# EAGLE design charger_v1 (EAGLE 4.16)
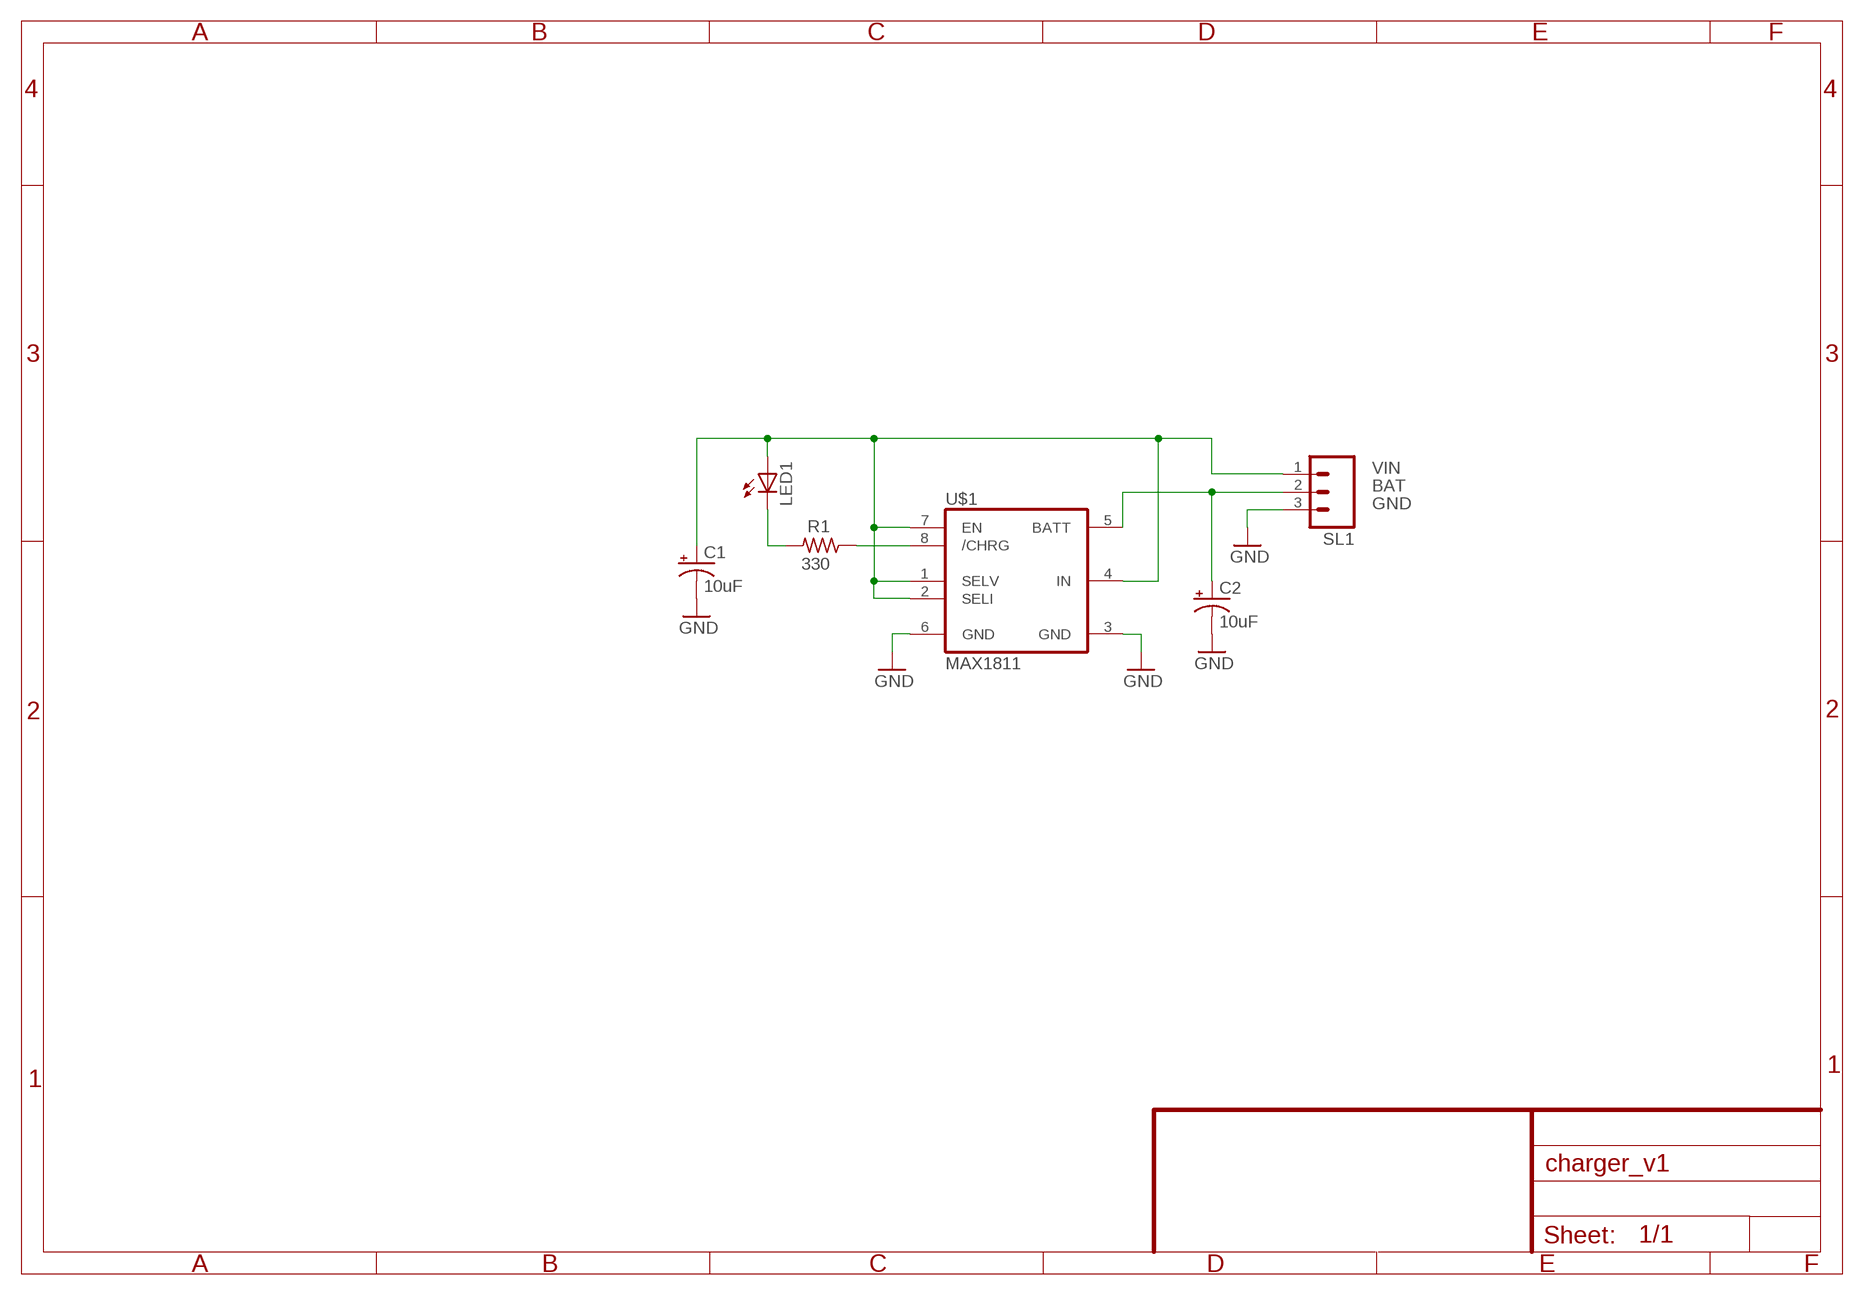
[diagram p0: schematic, sheet 1]

## Parts
C1  10uF  CAP_POL1206  [EIA3216]
C2  10uF  CAP_POL1206  [EIA3216]
LED1  LED1206  [LED-1206]
R1  330  R-US_0207/10  [0207/10]
SL1  M03PTH  [1X03]
U$1  MAX1811  [SO08]

## Nets
BAT: C2.A(+) SL1.2 U$1.5(BATT)
GND: C1.C(-) C2.C(-) SL1.3 U$1.3(GND) U$1.6(GND)
N$2: LED1.C R1.2
N$3: R1.1 U$1.8(/CHRG)
VIN: C1.A(+) LED1.A SL1.1 U$1.1(SELV) U$1.2(SELI) U$1.4(IN) U$1.7(EN)

## Library data of the parts
C1 C2 = SparkFunEagle-6-6-07:CAP_POL: Capacitor Polarized These are standard SMD and PTH capacitors. Normally 10uF, 47uF, and 100uF in electrolytic and tantalum varieties. Always verify the external diameter of the through hole cap, it varies with capacity, voltage, and manufacturer. The EIA devices should be standard.
LED1 = SparkFunEagle-6-6-07:LED: LEDs Standard schematic elements and footprints for 5mm, 3mm, 1206, and 0603 sized LEDs. 5mm - Spark Fun Electronics SKU : COM-00529 (and others)
R1 = rcl:R-US_: RESISTOR, American symbol
SL1 = SparkFunEagle-6-6-07:M03: Header 3 Standard 3-pin 0.1" header. Use with straight break away headers (SKU : PRT-00116), right angle break away headers (PRT-00553), swiss pins (PRT-00743), machine pins (PRT-00117), and female headers (PRT-00115). Molex polarized connector foot print use with SKU : PRT-08232 with associated crimp pins and housings.
U$1 = max1811:MAX1811

## Board
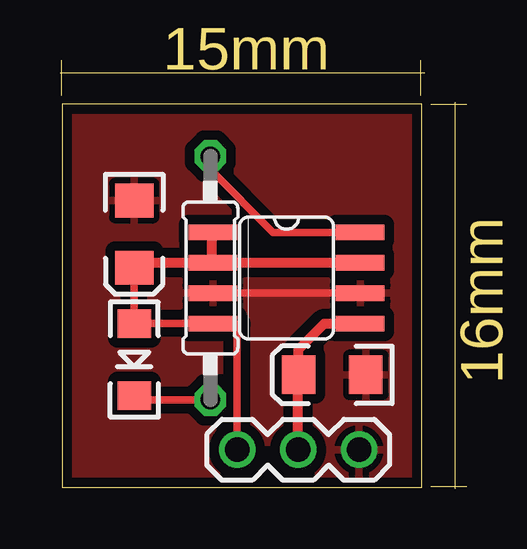
[diagram p1: board, top side]
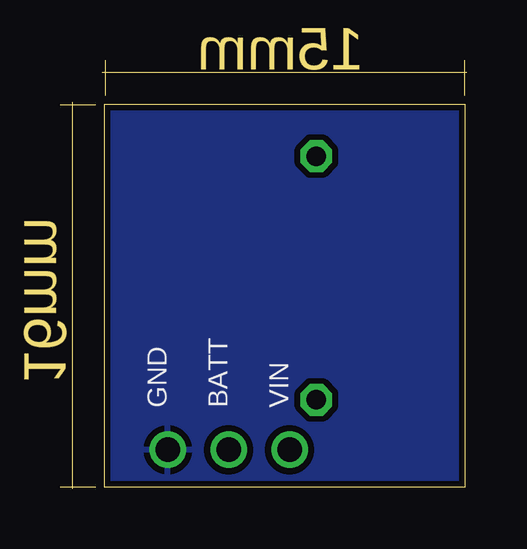
[diagram p2: board, bottom side, seen from below]

Size 16.97 x 17.88 mm. Coordinates in mm from the lower left corner, seen from the top.
Outline: 0.08,16.38 0.08,17.88
Outline: 15.06,16.38 15.06,17.88
Outline: 16.97,16.03 15.47,16.03
Outline: 16.97,0.08 15.47,0.08
Outline: 0,17.35 15.21,17.35
Outline: 16.46,16.13 16.46,0
Outline: 0.09,0.06 15.1,0.06 15.1,16.05 0.09,16.05 0.09,0.06
Copper layers (1*16): Top 0.035mm / dielectric 1.5mm / Bottom 0.035mm
Design rules "myrules": minimum track width 10mil, minimum drill 24mil, track to track 8mil, track to pad 8mil, pad to pad 8mil, via to via 8mil, smd to smd 8mil, copper to edge 8mil, drill to drill 8mil, minimum pad ring 10mil, minimum via ring 8mil, stop-mask expansion 4mil, vias tented up to drill 0mil, thermal gap 10mil

### Footprints (pad centres in the part's own frame; a part is rotated, then mirrored left to right if it is on the bottom)
EIA3216 = smd 1.4 x 1.6: A 1.4,0; C -1.4,0
LED-1206 = smd 1.2 x 1.4: A -1.5,0; C 1.5,0
0207/10 = drill 0.813 octagon: 1 -5.08,0; 2 5.08,0
1X03 = drill 1.016 round: 1 0,0; 2 2.54,0; 3 5.08,0
SO08 = smd 0.66 x 2.032: 1 -1.905,-3.073; 2 -0.635,-3.073; 3 0.635,-3.073; 4 1.905,-3.073; 5 1.905,3.073; 6 0.635,3.073; 7 -0.635,3.073; 8 -1.905,3.073

### Placement (x,y rotation side)
C1  [EIA3216]  3.1,10.62 270 top
C2  [EIA3216]  11.35,4.75 180 top
LED1  3.1,5.38 270 top
R1  [0207/10]  6.27,8.79 270 top
SL1  7.39,1.63 0 top
U$1  9.45,8.79 270 top

### Tracks (layer width: path | path; a pad name or v marks a point on that pad's centre or on a via)
BAT
  Top 0.305: C2.A 9.95,4.78 9.93,4.78 9.86,4.78 | U$1.5 12.62,6.88
  Top 0.406: SL1.2 9.93,4.78 | C2.A 9.95,5.81 11.02,6.88 U$1.5
GND
  Top 0.305: U$1.3 6.15,8.15 | 6.15,8.15 U$1.6 | 6.15,8.15 6.02,8.28
  pour Top (isolate 0.406): 0.08,16.05 15.11,16.05 15.11,0.03 0.08,0.03
  pour Bottom (isolate 0.254): 0.08,16.08 15.06,16.08 15.06,0.08 0.08,0.08
N$2
  Top 0.305: 3.18,3.89 3.18,3.94 | LED1.C 3.18,3.89 | R1.2 3.18,3.71 3.18,3.89
N$3
  Top 0.305: R1.1 6.27,13.31 8.89,10.69 12.42,10.69 12.52,10.8 | 12.52,10.8 12.55,10.82 | 12.52,10.8 U$1.8
VIN
  Top 0.305: 6.25,9.45 6.25,9.42 6.35,9.42 U$1.2 | 3.07,9.42 3.07,9.22 C1.A LED1.A U$1.4 6.38,6.86 | 6.35,10.69 U$1.1 | 6.38,6.86 6.3,6.86 | SL1.1 7.39,6.86 6.38,6.86
  Top 0.406: U$1.2 U$1.7 | 3.07,9.42 6.35,9.42 6.35,10.69

### Text on the board
Dimension: 15mm | 16mm
bNames: VIN | BATT | GND